# EAGLE schematic test_query (EAGLE 7.4.0)
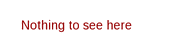
[diagram p0: schematic, sheet 1]

## Parts
TEST_POLY  TEST-POLYGON  [TEST-POLYGON]

## Library data of the parts
TEST_POLY = Swoop-Test-Packages:TEST-POLYGON